# Altium schematic sheet Sheet1.SchDoc
size A4; SheetNumber: 1; SheetTotal: 2
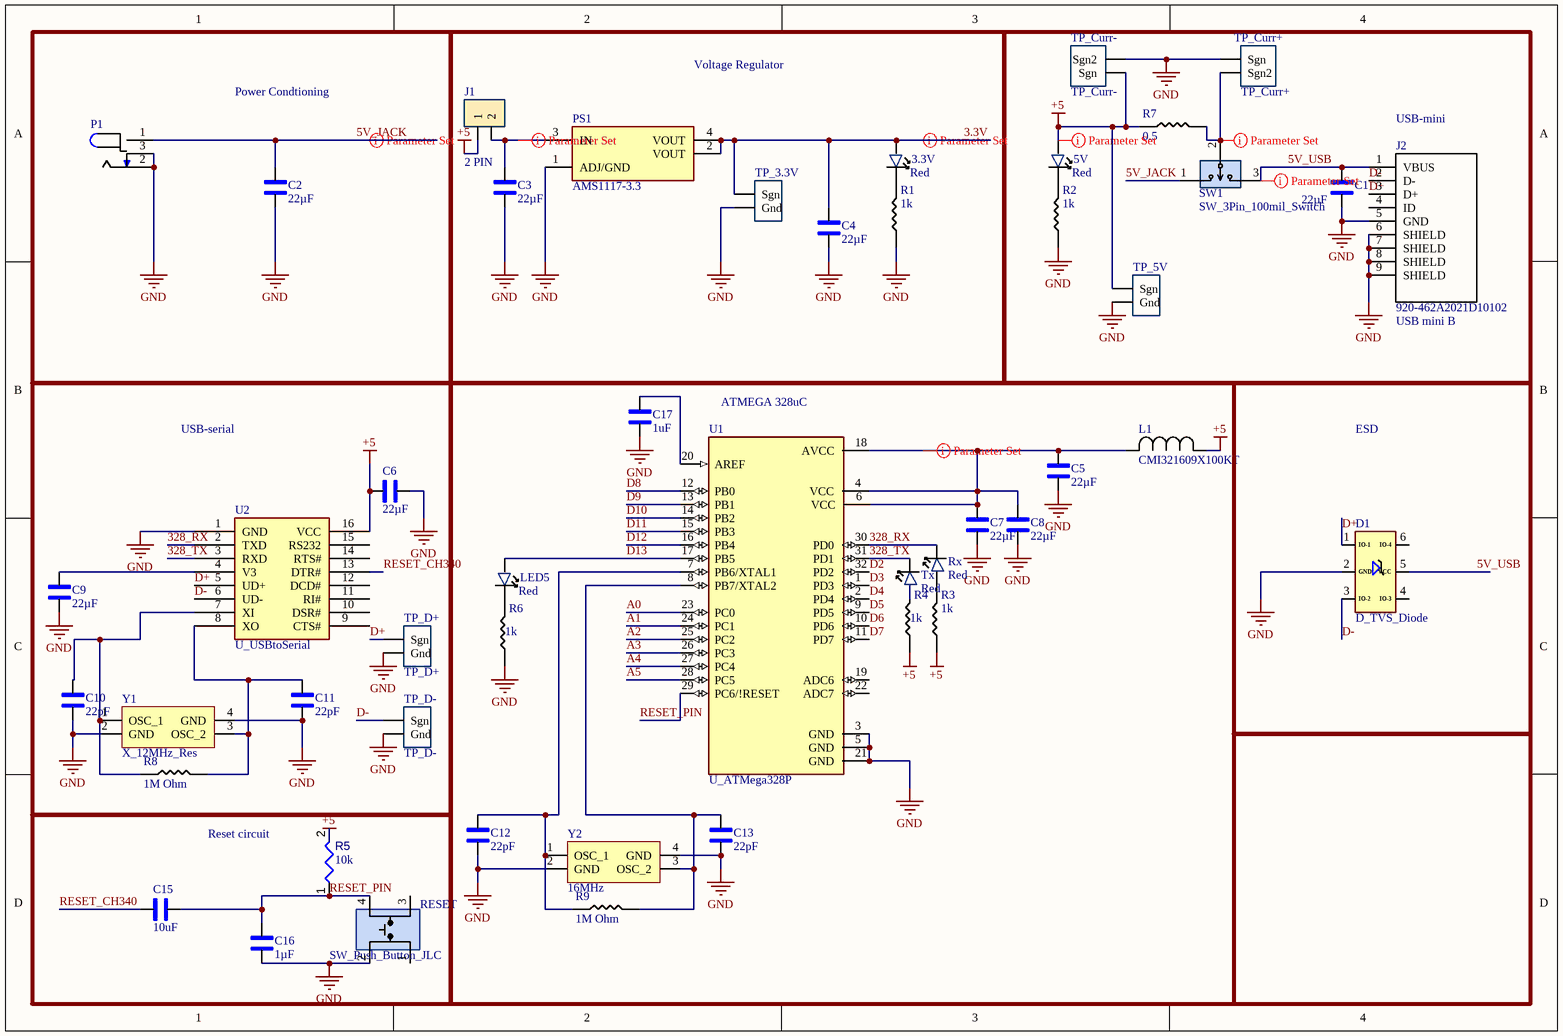
[diagram p0: Sheet1.SchDoc]

## Parts
3.3V  value Red  [LED_1206]  (hidden comment: LED_RED_1206)
5V  value Red  [LED_1206]  (hidden comment: LED_RED_1206)
C1  value 22µF  [1206_Passive_Capacitor]  (hidden comment: C_22uF_1206)
C2  value 22µF  [1206_Passive_Capacitor]  (hidden comment: C_22uF_1206)
C3  value 22µF  [1206_Passive_Capacitor]  (hidden comment: C_22uF_1206)
C4  value 22µF  [1206_Passive_Capacitor]  (hidden comment: C_22uF_1206)
C5  value 22µF  [1206_Passive_Capacitor]  (hidden comment: C_22uF_1206)
C6  value 22µF  [1206_Passive_Capacitor]  (hidden comment: C_22uF_1206)
C7  value 22µF  [1206_Passive_Capacitor]  (hidden comment: C_22uF_1206)
C8  value 22µF  [1206_Passive_Capacitor]  (hidden comment: C_22uF_1206)
C9  value 22µF  [1206_Passive_Capacitor]  (hidden comment: C_22uF_1206)
C10  value 22pF  [1206_Passive_Capacitor]  (hidden comment: C_22uF_1206)
C11  value 22pF  [1206_Passive_Capacitor]  (hidden comment: C_22uF_1206)
C12  value 22pF  [1206_Passive_Capacitor]  (hidden comment: C_22uF_1206)
C13  value 22pF  [1206_Passive_Capacitor]  (hidden comment: C_22uF_1206)
C15  10uF  [1206_Passive_Capacitor]
C16  value 1µF  [1206_Passive_Capacitor]  (hidden comment: C_1uF_1206)
C17  1uF  [1206_Passive_Capacitor]
D1  D_TVS_Diode  [TVS]
J1  value 2 PIN  [2_PIN_100MIL]  (hidden comment: JM_2_PIN_MALE)
J2  value USB mini B  MFR Part #: 920-462A2021D10102  [USB_MINI_B]  (hidden comment: J_USB_B_Mini)
L1  MFR PART #: CMI321609X100KT  [AIML-1206_ABR-M]  (hidden comment: FB_10uH_1206)
LED5  value Red  [LED_1206]  (hidden comment: LED_RED_1206)
P1  P_Power Jack  [Power_Jack]  (value not drawn)
PS1  MFR Part #: AMS1117-3.3  [LDO]  (hidden comment: PS_AMS_LDO_3v3)
R1  value 1k  [1206_Passive_Resitor]  (hidden comment: R_1K_1206)
R2  value 1k  [1206_Passive_Resitor]  (hidden comment: R_1K_1206)
R3  value 1k  [1206_Passive_Resitor]  (hidden comment: R_1K_1206)
R4  value 1k  [1206_Passive_Resitor]  (hidden comment: R_1K_1206)
R5  value 10k  [RESC3216X60X45ML15T20]  (hidden comment: Resistor 10k +/-1% 1206 250 mW)
R6  value 1k  [1206_Passive_Resitor]  (hidden comment: R_1K_1206)
R7  value 0.5  [1206_Passive_Resitor]  (hidden comment: R_500mOhm_1206)
R8  value 1M Ohm  [1206_Passive_Resitor]  (hidden comment: 1M)
R9  value 1M Ohm  [1206_Passive_Resitor]  (hidden comment: 1M)
RESET  SW_Push_Button_JLC  [Switch_JLC]
Rx  value Red  [LED_1206]  (hidden comment: LED_RED_1206)
SW1  SW_3Pin_100mil_Switch  [3_PIN_100mil]
TP_3.3V  TP_10x_Probe  [TP10x_Probe]  (value not drawn)
TP_5V  TP_10x_Probe  [TP10x_Probe]  (value not drawn)
TP_Curr+  TP_Curr+  [TP_Diff_Probe]
TP_Curr-  TP_Curr-  [TP_Diff_Probe]
TP_D+  TP_D+  [TP10x_Probe]
TP_D-  TP_D-  [TP10x_Probe]
Tx  value Red  [LED_1206]  (hidden comment: LED_RED_1206)
U1  U_ATMega328P  [ATMega328P]
U2  U_USBtoSerial  [USB to serial]
Y1  X_12MHz_Res  [Crystal resonator]
Y2  value 16MHz  [Crystal resonator]  (hidden comment: X322516MLB4SI)

## Blocks framed on the sheet
Power Condtioning: C2 P1
Voltage Regulator: 3.3V C3 C4 J1 PS1 R1 TP_3.3V
USB-mini: 5V C1 J2 R2 R7 SW1 TP_5V TP_Curr+ TP_Curr-
USB-serial: C6 C9-C11 R8 TP_D+ TP_D- U2 Y1
ATMEGA 328uC: C5 C7 C8 C12 C13 C17 L1 LED5 R3 R4 R6 R9 Rx Tx U1 Y2
ESD: D1
Reset circuit: C15 C16 R5 RESET

## Nets
+5: 5V.1 C6.1 J1.1 L1.1 R3.1 R4.1 R5.2 R7.1 TP_5V.1(Sgn) TP_Curr-.1(Sgn) U2.16(VCC)
GND: C1.1 C2.1 C3.2 C4.2 C5.1 C6.2 C7.1 C8.1 C9.2 C10.1 C11.1 C12.1 C13.1 C16.1 C17.2 D1.2(GND) J2.5(GND) J2.6(SHIELD) J2.7(SHIELD) J2.8(SHIELD) J2.9(SHIELD) P1.2 P1.3 PS1.1(ADJ/GND) R1.1 R2.1 R6.1 RESET.2 TP_3.3V.2(Gnd) TP_5V.2(Gnd) TP_Curr+.1(Sgn) TP_Curr-.2(Sgn2) TP_D+.2(Gnd) TP_D-.2(Gnd) U1.3(GND) U1.5(GND) U1.21(GND) U2.1(GND) Y1.2(GND) Y1.4(GND) Y2.2(GND) Y2.4(GND)
3.3V: 3.3V.1 C4.1 PS1.2(VOUT) PS1.4(VOUT) TP_3.3V.1(Sgn)
5V_JACK: C2.2 P1.1 SW1.1
5V_USB: C1.2 D1.5(VCC) J2.1(VBUS) SW1.3
328_RX: Rx.2 U1.30(PD0) U2.2(TXD)
328_TX: Tx.2 U1.31(PD1) U2.3(RXD)
A0: U1.23(PC0)
A1: U1.24(PC1)
A2: U1.25(PC2)
A3: U1.26(PC3)
A4: U1.27(PC4)
A5: U1.28(PC5)
D2: U1.32(PD2)
D3: U1.1(PD3)
D4: U1.2(PD4)
D5: U1.9(PD5)
D6: U1.10(PD6)
D7: U1.11(PD7)
D8: U1.12(PB0)
D9: U1.13(PB1)
D10: U1.14(PB2)
D11: U1.15(PB3)
D12: U1.16(PB4)
D13: LED5.1 U1.17(PB5)
D+: D1.1(IO-1) J2.3(D+) TP_D+.1(Sgn) U2.5(UD+)
D-: D1.3(IO-2) J2.2(D-) TP_D-.1(Sgn) U2.6(UD-)
RESET_CH340: C15.1 U2.13(DTR#)
RESET_PIN: C15.2 C16.2 R5.1 RESET.4 U1.29(PC6/!RESET)
Net3.3V_2: 3.3V.2 R1.2
Net5V_2: 5V.2 R2.2
NetC3_1: C3.1 J1.2 PS1.3(IN)
NetC5_2: C5.2 C7.2 C8.2 L1.2 U1.4(VCC) U1.6(VCC) U1.18(AVCC)
NetC9_1: C9.1 U2.4(V3)
NetC10_2: C10.2 R8.1 U2.7(XI) Y1.1(OSC_1)
NetC11_2: C11.2 R8.2 U2.8(XO) Y1.3(OSC_2)
NetC12_2: C12.2 R9.1 U1.7(PB6/XTAL1) Y2.1(OSC_1)
NetC13_2: C13.2 R9.2 U1.8(PB7/XTAL2) Y2.3(OSC_2)
NetC17_1: C17.1 U1.20(AREF)
NetLED5_2: LED5.2 R6.2
NetR3_2: R3.2 Rx.1
NetR4_2: R4.2 Tx.1
NetR7_2: R7.2 SW1.2 TP_Curr+.2(Sgn2)

Not connected (* = marked no-connect by the designer): D1 4(IO-3) 6(IO-4); J2 4(ID); RESET 1 3; U1 19(ADC6) 22(ADC7); U2 9(CTS#) 10(DSR#) 11(RI#) 12(DCD#) 14(RTS#) 15(RS232)

## Layout directives
rule Width Constraint [Pref Width = 20mil    Min Width = 20mil    Max Width = 30mil]: 3.3V, 5V_JACK, 5V_USB, +5, NetC3_1, NetC5_2, NetR7_2

## Library data of the parts
3.3V 5V Rx Tx = CMP-007-00045-1: Red 621~631nm 1206 Light Emitting Diodes (LED) RoHS; MFR Part #: 15-21/R6C-FQ1R1B/2T; Source: ECEN5730Lib_2023_05_DS.SchLib; LCSC Part#: C93133; Design Item ID: LED_RED_1206; Type: Extended; Pins: 2; Component Type: Standard; Datasheet: https://datasheet.lcsc.com/szlcsc/1811151241_Everlight-Elec-15-21-R6C-FQ1R1B-2T_C93133.pdf
C1-C4 C6 C9-C13 = CMP-001-00089-1: 22uF ±10% 25V X5R 1206 Multilayer Ceramic Capacitors MLCC - SMD/SMT RoHS; MFR Part #: CL31A226KAHNNNE; Type: basic; Design Item ID: C_22uF_1206; Datasheet: https://datasheet.lcsc.com/lcsc/1811031514_Samsung-Electro-Mechanics-CL31A226KAHNNNE_C12891.pdf; LCSC Part#: C12891; Component Type: Standard; Pins: 2; Source: ECEN5730Lib_2023_05_DS.SchLib
C5 C7 C8 = CMP-001-00098-1: 22uF ±10% 25V X5R 1206 Multilayer Ceramic Capacitors MLCC - SMD/SMT RoHS; MFR Part #: CL31A226KAHNNNE; Type: basic; Design Item ID: C_22uF_1206; LCSC Part#: C12891; Datasheet: https://datasheet.lcsc.com/lcsc/1811031514_Samsung-Electro-Mechanics-CL31A226KAHNNNE_C12891.pdf; Pins: 2; Component Type: Standard; Source: ECEN5730Lib_2023_05_DS.SchLib
C15 = C_10uF_1206: 10uF ±10% 50V X5R 1206 Multilayer Ceramic Capacitors MLCC - SMD/SMT RoHS; MFR Part #: CL31A106KBHNNNE; Type: Basic; LCSC Part#: C13585; Datasheet: https://datasheet.lcsc.com/lcsc/1810221112_Samsung-Electro-Mechanics-CL31A106KBHNNNE_C13585.pdf; Value: 10uF
C16 = CMP-001-00095-1: MULTILAYER CERAMIC CAPACITORS MLCC - SMD/SMT 1UF 50V 1206 ROHS; MFR Part #: CL31B105KBHNNNE; Type: Basic; Source: ECEN5730Lib_2023_05_DS.SchLib; Pins: 2; Digikey Link: https://www.digikey.com/product-detail/en/C1206C105M4RACTU/399-8150-1-ND/3471873/?itemSeq=304982366; LCSC Part#: C1848; Component Type: Standard; Design Item ID: C_1uF_1206
C17 = C_1uF_1206: MULTILAYER CERAMIC CAPACITORS MLCC - SMD/SMT 1UF 50V 1206 ROHS; MFR Part #: CL31B105KBHNNNE; Type: Basic; Digikey Link: https://www.digikey.com/product-detail/en/C1206C105M4RACTU/399-8150-1-ND/3471873/?itemSeq=304982366; LCSC Part#: C1848; Value: 1uF
D1 = CMP-004-00031-1: TVS SOT-23-6 ROHS; MFR Part #: SRV05-4-P-T7; Type: Basic; Value: TVS DIODE 5.5V 6TSOP; LCSC Part#: C85364; Pins: 6; Design Item ID: D_TVS_Diode; Datasheet: https://datasheet.lcsc.com/szlcsc/ProTek-Devices-SRV05-4-P-T7_C85364.pdf; Component Type: Standard; Source: ECEN5730Lib_2023_05_DS.SchLib
J1 = CMP-002-00089-1: 2.54mm Straight 2 1 Header,Breakaway Through Hole,P=2.54mm Pin Header & Female Header ROHS; MFR Part #: B-2100S02P-A110; LCSC Part#: C124375; Source: ECEN5730Lib_2023_05_DS.SchLib; Type: Extended; Pins: 2; Datasheet: https://datasheet.lcsc.com/lcsc/1811151421_Ckmtw-Shenzhen-Cankemeng-B-2100S02P-A110_C124375.pdf; Component Type: Standard; Design Item ID: JM_2_PIN_MALE
J2 = CMP-013-000002-1: Through Hole USB Connectors RoHS; Type: Extended; Design Item ID: J_USB_B_Mini; LCSC Part#: C46398; Pin Count: 9; Component Type: Standard; Datasheet: https://datasheet.lcsc.com/szlcsc/2103081233_Jing-Extension-of-the-Electronic-Co-920-462A2021D10102_C46398.pdf; Source: ECEN5730Lib_2023_05_DS.SchLib
L1 = CMP-006-00021-1: 25mA 10uH ±10% 800mO 1206  Inductors (SMD) ROHS; Mfr_Name: FH (Guangdong Fenghua Advanced Tech); Type: Basic; LCSC PART#: C1051; Source: ECEN5730Lib_2023_05_DS.SchLib; Pins: 2; Design Item ID: FB_10uH_1206; DataSheet: https://datasheet.lcsc.com/lcsc/1810311314_FH--Guangdong-Fenghua-Advanced-Tech-CMI321609X100KT_C1051.pdf; Component Type: Standard
LED5 = CMP-007-00045-1: Red 621~631nm 1206 Light Emitting Diodes (LED) RoHS; MFR Part #: 15-21/R6C-FQ1R1B/2T; Type: Extended; Source: ECEN5730Lib_2023_05_DS.SchLib; LCSC Part#: C93133; Design Item ID: LED_RED_1206; Pins: 2; Component Type: Standard; Datasheet: https://datasheet.lcsc.com/szlcsc/1811151241_Everlight-Elec-15-21-R6C-FQ1R1B-2T_C93133.pdf
P1 = CMP-002-00097-1: Power Barrel Connector Jack 2.10mm ID (0.083"), 5.50mm OD (0.217") Through Hole, Right Angle; MFR Part #: PJ-102A; Value: CONN PWR JACK 2X5.5MM SOLDER; Component Type: Standard; LCSC Part#: C136744; Source: ECEN5730Lib_2023_05_DS.SchLib; Type: Extended; Digikey Link: https://www.digikey.com/product-detail/en/PJ-102A/CP-102A-ND/275425/?itemSeq=304982367; Pins: 3; Design Item ID: P_Power Jack
PS1 = CMP-017-000002-1: LOW DROPOUT REGULATORS(LDO) POSITIVE FIXED 1.3V @ 800MA 15V 3.3V 1A SOT-223 ROHS; Value: IC REG LINEAR 3.3V 800MA SOT223; Component Type: Standard; Source: ECEN5730Lib_2023_05_DS.SchLib; Type: Basic; Design Item ID: PS_AMS_LDO_3v3; Pin Count: 4; LCSC Part#: C6186
R1-R4 R6 = CMP-009-00194-1: CHIP RESISTOR - SURFACE MOUNT 1KOHMS ±1% 1/4W 1206 ROHS; MFR Part #: RNCP1206FTD1K00CT; LCSC Part#: C4410; Pins: 2; Source: ECEN5730Lib_2023_05_DS.SchLib; Digikey Link: https://www.digikey.com/product-detail/en/RNCP1206FTD1K00/RNCP1206FTD1K00CT-ND/2240675/?itemSeq=304982373; Type: Basic; Component Type: Standard; Design Item ID: R_1K_1206
R5 = CMP-009-00016-5: Chip Resistor, 10 KOhm, +/- 1%, 0.25 W, -55 to 155 degC, 1206 (3216 Metric); Power: 250mW; Voltage Rating: 200V; Pins: 2; Max Operating Temperature: 155°C; Tolerance: 1%; RoHS Compliant: True; Case/Package: 1206; Min Operating Temperature: -55°C; Mounting Technology: SM
R7 = CMP-009-00210-1: Resistors/Shunt 250mW 500mO ±800ppm/? ±5% 1206  Current Sense  Resistors ROHS; MFR Part #: 1206W4J050KT5E; Datasheet: https://datasheet.lcsc.com/lcsc/1810301438_UNI-ROYAL-Uniroyal-Elec-1206W4J050KT5E_C247433.pdf; Component Type: Standard; Pins: 2; LCSC Part#: C247433; Design Item ID: R_500mOhm_1206; Type: Extended; Source: ECEN5730Lib_2023_05_DS.SchLib
R8 R9 = R_1M_1206: CHIP RESISTOR - SURFACE MOUNT 1MOHMS ±1% 1/4W 1206 ROHS; MFR Part #: RMCF1206JT1M00; Digikey Link: https://www.digikey.com/product-detail/en/RMCF1206JT1M00/RMCF1206JT1M00CT-ND/1942830/?itemSeq=304982358; LCSC Part#: C17927; Type: Basic
RESET = CMP-011-00014-1: Tactile Switch SPST-NO Top Actuated Surface Mount; MFR Part #: KH-4.5X4.5X4.3H-STM; Type: Extended; Pins: 4; DataSheet: https://datasheet.lcsc.com/lcsc/2106081532_Shenzhen-Kinghelm-Elec-KH-4.5X4.5X4.3H-STM_C2837550.pdf; Source: ECEN5730Lib_2023_05_DS.SchLib; Component Type: Standard; Design Item ID: SW_Push_Button_JLC; LCSC Part#: C2837550
SW1 = CMP-002-00126-1: Connector Header Through Hole 3 position 0.100" (2.54mm); MFR Part #: PREC003SAAN-RC; Value: CONN HEADER VERT 3POS 2.54MM; Type: Extended; LCSC Part#: C49257; Source: ECEN5730Lib_2023_05_DS.SchLib; Pins: 3; Design Item ID: SW_3Pin_100mil_Switch; Component Type: Standard; Digikey Link: https://www.digikey.com/product-detail/en/PREC003SAAN-RC/S1012EC-03-ND/2774851/?itemSeq=304982371
TP_3.3V TP_5V = CMP-016-000001-1: Test Point 300 mil centers; Source: ECEN5730Lib_2023_05_DS.SchLib; Design Item ID: TP_10x_Probe; Pin Count: 2; Component Type: Standard
TP_Curr+ TP_Curr- = CMP-016-000002-1: Test Point 300 mil centers; Component Type: Standard; Source: ECEN5730Lib_2023_05_DS.SchLib; Pin Count: 2; Design Item ID: TP_Diff_Probe
TP_D+ TP_D- = CMP-016-000004-1: Test Point 300 mil centers; Component Type: Standard; Design Item ID: TP_10x_Probe; Source: ECEN5730Lib_2023_05_DS.SchLib; Pin Count: 2
U1 = CMP-031-00012-1: AVR AVR® ATmega Microcontroller IC 8-Bit 20MHz 32KB (16K x 16) FLASH 32-TQFP (7x7); MFR Part #: ATMEGA328P-AU; Value: IC MCU 8BIT 32KB FLASH 32TQFP; Design Item ID: U_ATMega328P; Pins: 32; Component Type: Standard; Source: ECEN5730Lib_2023_05_DS.SchLib; Type: Basic; LCSC Part#: C14877; DigiKey link: https://www.digikey.com/product-detail/en/ATMEGA328P-ANR/ATMEGA328P-ANRCT-ND/2774230/?itemSeq=304982365
U2 = CMP-031-00016-1: Transceiver USB 2.0 2Mbps SOP-16_150mil USB ICs RoHS; MFR Part #: CH340G; Value: USB to Serial; Component Type: Standard; LCSC Part#: C14267; Design Item ID: U_USBtoSerial; Type: Basic; Datasheet: https://datasheet.lcsc.com/lcsc/2008191806_WCH-Jiangsu-Qin-Heng-CH340G_C14267.pdf; Source: ECEN5730Lib_2023_05_DS.SchLib; Pins: 16
Y1 = CMP-003-00030-1: SMD Crystal Resonators 12MHz ±10ppm SMD-3225_4P RoHS; MFR Part #: X322512MSB4SI; Design Item ID: X_12MHz_Res; Type: Basic; Pins: 4; Value: 12MHz; Datasheet: https://datasheet.lcsc.com/szlcsc/Yangxing-Tech-X322512MSB4SI_C9002.pdf; Source: ECEN5730Lib_2023_05_DS.SchLib; LCSC Part#: C9002; Component Type: Standard
Y2 = X_16Mhz_Res: ±10ppm 16000000Hz -40℃~85℃ 贴片无源晶振 60Ω 9pF SMD3225-4P Crystals ROHS; LCSC Part#: C13738; MFR Part #: X322516MLB4SI; Type: Basic